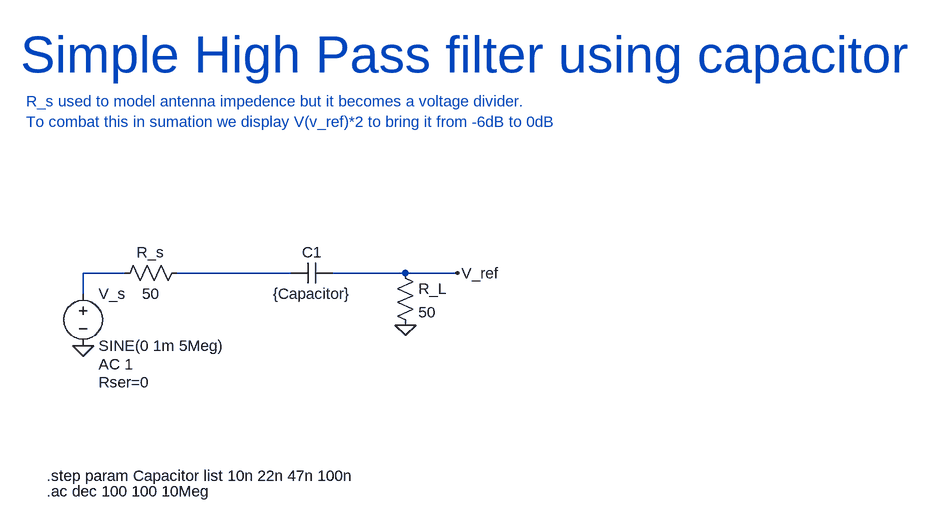
[diagram p0: schematic Capacitor_Fileter.asc]
Capacitor_Fileter.asc, the LTspice schematic file:
Version 4.1
SHEET 1 1368 680
WIRE 32 80 -32 80
WIRE 288 80 112 80
WIRE 464 80 352 80
WIRE 544 80 464 80
WIRE -32 112 -32 80
FLAG -32 192 0
FLAG 544 80 V_ref
FLAG 464 160 0
SYMBOL voltage -32 96 R0
WINDOW 123 24 124 Left 2
WINDOW 39 24 152 Left 2
SYMATTR InstName V_s
SYMATTR Value SINE(0 1m 5Meg)
SYMATTR Value2 AC 1
SYMATTR SpiceLine Rser=0
SYMBOL cap 352 64 R90
WINDOW 0 0 32 VBottom 2
WINDOW 3 32 32 VTop 2
SYMATTR InstName C1
SYMATTR Value {Capacitor}
SYMBOL res 448 64 R0
SYMATTR InstName R_L
SYMATTR Value 50
SYMBOL res 128 64 R90
WINDOW 0 0 56 VBottom 2
WINDOW 3 32 56 VTop 2
SYMATTR InstName R_s
SYMATTR Value 50
TEXT -88 392 Left 2 !.step param Capacitor list 10n 22n 47n 100n
TEXT -88 416 Left 2 !.ac dec 100 100 10Meg
TEXT -120 -184 Left 2 ;R_s used to model antenna impedence but it becomes a voltage divider.\nTo combat this in sumation we display V(v_ref)*2 to bring it from -6dB to 0dB
TEXT -128 -256 Left 6 ;Simple High Pass filter using capacitor

The netlist it stands for:
* Capacitor_Fileter.asc
V_s N001 0 SINE(0 1m 5Meg) AC 1 Rser=0
C1 V_ref N002 {Capacitor}
R_L V_ref 0 50
R_s N002 N001 50
.step param Capacitor list 10n 22n 47n 100n
.ac dec 100 100 10Meg
* R_s used to model antenna impedence but it becomes a voltage divider.
* To combat this in sumation we display V(v_ref)*2 to bring it from -6dB to 0dB
* Simple High Pass filter using capacitor
.backanno
.end